# EAGLE design CorruptCore (EAGLE 8.3.1)
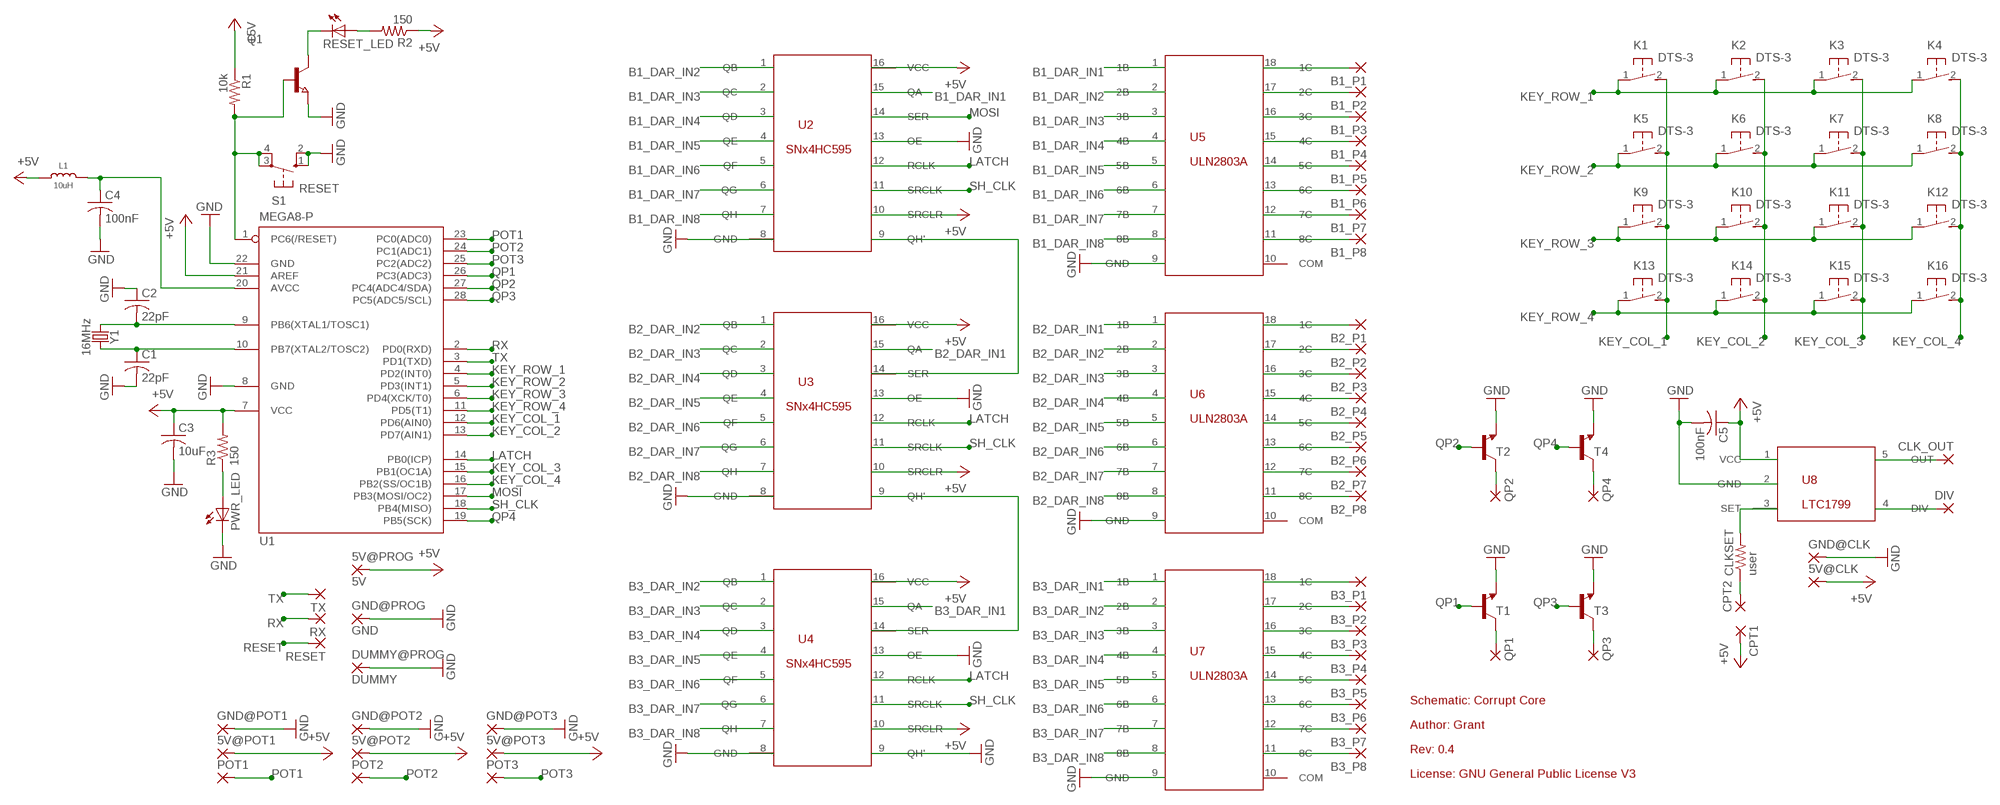
[diagram p0: schematic, sheet 1]

## Parts
5V@CLK  1,6/0,8  [1,6/0,8]
5V@POT1  1,6/0,8  [1,6/0,8]
5V@POT2  1,6/0,8  [1,6/0,8]
5V@POT3  1,6/0,8  [1,6/0,8]
5V@PROG  5V  1,6/0,8  [1,6/0,8]
B1_P1  1,6/0,8  [1,6/0,8]
B1_P2  1,6/0,8  [1,6/0,8]
B1_P3  1,6/0,8  [1,6/0,8]
B1_P4  1,6/0,8  [1,6/0,8]
B1_P5  1,6/0,8  [1,6/0,8]
B1_P6  1,6/0,8  [1,6/0,8]
B1_P7  1,6/0,8  [1,6/0,8]
B1_P8  1,6/0,8  [1,6/0,8]
B2_P1  1,6/0,8  [1,6/0,8]
B2_P2  1,6/0,8  [1,6/0,8]
B2_P3  1,6/0,8  [1,6/0,8]
B2_P4  1,6/0,8  [1,6/0,8]
B2_P5  1,6/0,8  [1,6/0,8]
B2_P6  1,6/0,8  [1,6/0,8]
B2_P7  1,6/0,8  [1,6/0,8]
B2_P8  1,6/0,8  [1,6/0,8]
B3_P1  1,6/0,8  [1,6/0,8]
B3_P2  1,6/0,8  [1,6/0,8]
B3_P3  1,6/0,8  [1,6/0,8]
B3_P4  1,6/0,8  [1,6/0,8]
B3_P5  1,6/0,8  [1,6/0,8]
B3_P6  1,6/0,8  [1,6/0,8]
B3_P7  1,6/0,8  [1,6/0,8]
B3_P8  1,6/0,8  [1,6/0,8]
C1  22pF  C-USC0805  [C0805]
C2  22pF  C-USC0805  [C0805]
C3  10uF  C-USC0805  [C0805]
C4  100nF  C-USC0805  [C0805]
C5  100nF  C-USC0805  [C0805]
CLK_OUT  1,6/0,8  [1,6/0,8]
CLKSET  user  R-US_0207/7  [0207/7]
CPT1  1,6/0,8  [1,6/0,8]
CPT2  1,6/0,8  [1,6/0,8]
DIV  1,6/0,8  [1,6/0,8]
DUMMY@PROG  DUMMY  1,6/0,8  [1,6/0,8]
GND@CLK  1,6/0,8  [1,6/0,8]
GND@POT1  1,6/0,8  [1,6/0,8]
GND@POT2  1,6/0,8  [1,6/0,8]
GND@POT3  1,6/0,8  [1,6/0,8]
GND@PROG  GND  1,6/0,8  [1,6/0,8]
K1  DTS-3  [DTS-3]
K2  DTS-3  [DTS-3]
K3  DTS-3  [DTS-3]
K4  DTS-3  [DTS-3]
K5  DTS-3  [DTS-3]
K6  DTS-3  [DTS-3]
K7  DTS-3  [DTS-3]
K8  DTS-3  [DTS-3]
K9  DTS-3  [DTS-3]
K10  DTS-3  [DTS-3]
K11  DTS-3  [DTS-3]
K12  DTS-3  [DTS-3]
K13  DTS-3  [DTS-3]
K14  DTS-3  [DTS-3]
K15  DTS-3  [DTS-3]
K16  DTS-3  [DTS-3]
L1  10uH  MICROBUILDER_INDUCTOR_0805  [MICROBUILDER__0805]
POT1  1,6/0,8  [1,6/0,8]
POT2  1,6/0,8  [1,6/0,8]
POT3  1,6/0,8  [1,6/0,8]
PWR_LED  LEDCHIPLED_0603  [CHIPLED_0603]
Q1  NPN-TRANSISTOR_SOT23  [SOT23]
QP1  1,6/0,8  [1,6/0,8]
QP2  1,6/0,8  [1,6/0,8]
QP3  1,6/0,8  [1,6/0,8]
QP4  1,6/0,8  [1,6/0,8]
R1  10k  R-US_R0805  [R0805]
R2  150  R-US_R0805  [R0805]
R3  150  R-US_R0805  [R0805]
RESET  1,6/0,8  [1,6/0,8]
RESET_LED  LEDCHIPLED_0603  [CHIPLED_0603]
RX  1,6/0,8  [1,6/0,8]
S1  RESET  10-XX  [B3F-10XX]
T1  TRANS_NPN-MMBTA42  [SOT23-3]
T2  TRANS_NPN-MMBTA42  [SOT23-3]
T3  TRANS_NPN-MMBTA42  [SOT23-3]
T4  TRANS_NPN-MMBTA42  [SOT23-3]
TX  1,6/0,8  [1,6/0,8]
U1  MEGA8-P  [DIL28-3]
U2  SNX4HC595SOIC16  [SOIC16N]
U3  SNX4HC595SOIC16  [SOIC16N]
U4  SNX4HC595SOIC16  [SOIC16N]
U5  ULN2803ASOIC18  [SO18L]
U6  ULN2803ASOIC18  [SO18L]
U7  ULN2803ASOIC18  [SO18L]
U8  LTC1799  [SOT23-5L]
Y1  16MHz  CRYSTAL-16MHZPTH-HC49US  [HC49US]

## Nets
+5V: 5V@CLK.1(P) 5V@POT1.1(P) 5V@POT2.1(P) 5V@POT3.1(P) 5V@PROG.1(P) C3.1 C5.1 CPT1.1(P) L1.1 R1.1 R2.1 R3.2 U1.7(VCC) U1.21(AREF) U2.10(SRCLR) U2.16(VCC) U3.10(SRCLR) U3.16(VCC) U4.10(SRCLR) U4.16(VCC) U8.1(VCC)
B1_DAR_IN1: U2.15(QA) U5.1(1B)
B1_DAR_IN2: U2.1(QB) U5.2(2B)
B1_DAR_IN3: U2.2(QC) U5.3(3B)
B1_DAR_IN4: U2.3(QD) U5.4(4B)
B1_DAR_IN5: U2.4(QE) U5.5(5B)
B1_DAR_IN6: U2.5(QF) U5.6(6B)
B1_DAR_IN7: U2.6(QG) U5.7(7B)
B1_DAR_IN8: U2.7(QH) U5.8(8B)
B1_P1: B1_P1.1(P) U5.18(1C)
B1_P2: B1_P2.1(P) U5.17(2C)
B1_P3: B1_P3.1(P) U5.16(3C)
B1_P4: B1_P4.1(P) U5.15(4C)
B1_P5: B1_P5.1(P) U5.14(5C)
B1_P6: B1_P6.1(P) U5.13(6C)
B1_P7: B1_P7.1(P) U5.12(7C)
B1_P8: B1_P8.1(P) U5.11(8C)
B2_DAR_IN1: U3.15(QA) U6.1(1B)
B2_DAR_IN2: U3.1(QB) U6.2(2B)
B2_DAR_IN3: U3.2(QC) U6.3(3B)
B2_DAR_IN4: U3.3(QD) U6.4(4B)
B2_DAR_IN5: U3.4(QE) U6.5(5B)
B2_DAR_IN6: U3.5(QF) U6.6(6B)
B2_DAR_IN7: U3.6(QG) U6.7(7B)
B2_DAR_IN8: U3.7(QH) U6.8(8B)
B2_P1: B2_P1.1(P) U6.18(1C)
B2_P2: B2_P2.1(P) U6.17(2C)
B2_P3: B2_P3.1(P) U6.16(3C)
B2_P4: B2_P4.1(P) U6.15(4C)
B2_P5: B2_P5.1(P) U6.14(5C)
B2_P6: B2_P6.1(P) U6.13(6C)
B2_P7: B2_P7.1(P) U6.12(7C)
B2_P8: B2_P8.1(P) U6.11(8C)
B3_DAR_IN1: U4.15(QA) U7.1(1B)
B3_DAR_IN2: U4.1(QB) U7.2(2B)
B3_DAR_IN3: U4.2(QC) U7.3(3B)
B3_DAR_IN4: U4.3(QD) U7.4(4B)
B3_DAR_IN5: U4.4(QE) U7.5(5B)
B3_DAR_IN6: U4.5(QF) U7.6(6B)
B3_DAR_IN7: U4.6(QG) U7.7(7B)
B3_DAR_IN8: U4.7(QH) U7.8(8B)
B3_P1: B3_P1.1(P) U7.18(1C)
B3_P2: B3_P2.1(P) U7.17(2C)
B3_P3: B3_P3.1(P) U7.16(3C)
B3_P4: B3_P4.1(P) U7.15(4C)
B3_P5: B3_P5.1(P) U7.14(5C)
B3_P6: B3_P6.1(P) U7.13(6C)
B3_P7: B3_P7.1(P) U7.12(7C)
B3_P8: B3_P8.1(P) U7.11(8C)
GND: C1.2 C2.1 C3.2 C4.2 C5.2 DUMMY@PROG.1(P) GND@CLK.1(P) GND@POT1.1(P) GND@POT2.1(P) GND@POT3.1(P) GND@PROG.1(P) PWR_LED.C Q1.2(E) S1.1(S) S1.2(S1) T1.2(E) T2.2(E) T3.2(E) T4.2(E) U1.8(GND) U1.22(GND) U2.8(GND) U2.13(OE) U3.8(GND) U3.13(OE) U4.8(GND) U4.9(QH') U4.13(OE) U5.9(GND) U6.9(GND) U7.9(GND) U8.2(GND)
KEY_COL_1: K1.2 K5.2 K9.2 K13.2 U1.12(PD6(AIN0))
KEY_COL_2: K2.2 K6.2 K10.2 K14.2 U1.13(PD7(AIN1))
KEY_COL_3: K3.2 K7.2 K11.2 K15.2 U1.15(PB1(OC1A))
KEY_COL_4: K4.2 K8.2 K12.2 K16.2 U1.16(PB2(SS/OC1B))
KEY_ROW_1: K1.1 K2.1 K3.1 K4.1 U1.4(PD2(INT0))
KEY_ROW_2: K5.1 K6.1 K7.1 K8.1 U1.5(PD3(INT1))
KEY_ROW_3: K9.1 K10.1 K11.1 K12.1 U1.6(PD4(XCK/T0))
KEY_ROW_4: K13.1 K14.1 K15.1 K16.1 U1.11(PD5(T1))
LATCH: U1.14(PB0(ICP)) U2.12(RCLK) U3.12(RCLK) U4.12(RCLK)
MOSI: U1.17(PB3(MOSI/OC2)) U2.14(SER)
N$1: U2.9(QH') U3.14(SER)
N$2: U3.9(QH') U4.14(SER)
N$3: C2.2 U1.9(PB6(XTAL1/TOSC1)) Y1.1
N$4: C1.1 U1.10(PB7(XTAL2/TOSC2)) Y1.2
N$5: CLK_OUT.1(P) U8.5(OUT)
N$6: R2.2 RESET_LED.A
N$7: PWR_LED.A R3.1
N$8: QP1.1(P) T1.3(C)
N$9: C4.1 L1.2 U1.20(AVCC)
N$10: QP2.1(P) T2.3(C)
N$11: QP3.1(P) T3.3(C)
N$12: QP4.1(P) T4.3(C)
N$13: DIV.1(P) U8.4(DIV)
N$14: CLKSET.1 CPT2.1(P)
N$16: CLKSET.2 U8.3(SET)
N$17: Q1.3(C) RESET_LED.C
POT1: POT1.1(P) U1.23(PC0(ADC0))
POT2: POT2.1(P) U1.24(PC1(ADC1))
POT3: POT3.1(P) U1.25(PC2(ADC2))
QP1: T1.1(B) U1.26(PC3(ADC3))
QP2: T2.1(B) U1.27(PC4(ADC4/SDA))
QP3: T3.1(B) U1.28(PC5(ADC5/SCL))
QP4: T4.1(B) U1.19(PB5(SCK))
RESET: Q1.1(B) R1.2 RESET.1(P) S1.3(P) S1.4(P1) U1.1(PC6(/RESET))
RX: RX.1(P) U1.2(PD0(RXD))
SH_CLK: U1.18(PB4(MISO)) U2.11(SRCLK) U3.11(SRCLK) U4.11(SRCLK)
TX: TX.1(P) U1.3(PD1(TXD))
Unconnected: U5.10(COM) U6.10(COM) U7.10(COM)

## Notes on the sheet
- Schematic: Corrupt Core
- Author: Grant
- Rev: 0.4
- License: GNU General Public License V3

## Library data of the parts
5V@CLK 5V@POT1-5V@POT3 5V@PROG B1_P1-B1_P8 B2_P1-B2_P8 B3_P1-B3_P8 CLK_OUT CPT1 CPT2 DIV DUMMY@PROG GND@CLK GND@POT1-GND@POT3 GND@PROG POT1-POT3 QP1-QP4 RESET RX TX = wirepad:1,6/0,8: THROUGH-HOLE PAD
C1-C5 = resistor:C-US: CAPACITOR, American symbol
CLKSET R1-R3 = resistor:R-US_: RESISTOR, American symbol
K1-K16 = switch-tact:DTS-3
L1 = piboy_new:MICROBUILDER_INDUCTOR: Inductors 0603: 10nH Ceramic Inductor - microwire antenna/RF (Digikey: 712-1434-2-ND) 0805: 560nH Ceramic Inductor - RF (Digikey: 553-1047-1-ND) 270nH Ceramic Inductor - Q = 40@250MHz, +-5%, 1 Ohm DC Resistance (Digikey: 535-10506-2-ND) 1007 (2518 Metric) SMT: 10µH 10% 250mOhm 820mA 1007 Inductor (Digikey: 587-2189-1-ND) 22µH 10% 500mOhm 580mA 1007 Inductor (Digikey: 587-2190-1-ND) 47µH 10% 950mOhm 420mA 1007 Inductor (Digikey: 587-2191-1-ND) 47µH 5% 100mOhm 1A 1008 Inductor (Digikey: 732-1816-1-ND) 5.0x5.0mm (Taiyo Yuden NR5040 Series) 6.8µH 20% 2.3A 64mOhm Inductor (Digikey: 587-2374-2-ND) 5.0x5.0mm (TDK VLC5045 Series) 4.7µH 20% 3.3A 34mOhm Inductor (Digikey: 445-6526-1-ND) 6.8µH 20% 2.7A 46mOhm Inductor (Digikey: 445-6527-1-ND) 6.0x6.0mm (TDK VLC6045 Series) 4.7µH 20% 3.8A 27mOhm Inductor (Digikey: 445-6538-2-ND) 6.8µH 20% 3A 41mOhm Inductor (Digikey: 445-6540-1-ND) 6.2µH 30% 2.2A 45mOhm Inductor (Digikey: SRR5028-6R2YCT-ND) - Not TDK VLC6045 but footprint should match 6.0x6.0mm (TDK SLF6045 Series) 6.8uH 30% 2A 33mOhm Inductor (Digikey: 445-4572-1-ND, Mouser: 810-SLF645T6R8N2R0PF) 6.0x6.0mm (Sumida CDRH5D28 Series) 6.2uH 30% 1.8A 45mOhm Inductor (Digikey: 308-1542-1-ND) Taiyo Yuden NR3015T2R2M - 2.2uH 20% 1.5A (Digikey: 587-1648-2-ND, Mouser: 963-NR3015T2R2M) - Used with TI TPS62172 CoilCraft RFID Transponder Coil - MA5532-AE (For use with AS3935 Lightning Sensor) Vishay IHLP 1.0uH Molded Inductor - 24mOhm DCR, 5A, +/-20%, -55°C-125°C (Digikey: 541-1319-1-ND)
PWR_LED RESET_LED = led:LED: LED OSRAM: - CHIPLED LG R971, LG N971, LY N971, LG Q971, LY Q971, LO R971, LY R971 LH N974, LH R974 LS Q976, LO Q976, LY Q976 LO Q996 - Hyper CHIPLED LW Q18S LB Q993, LB Q99A, LB R99A - SideLED LS A670, LO A670, LY A670, LG A670, LP A670 LB A673, LV A673, LT A673, LW A673 LH A674 LY A675 LS A676, LA A676, LO A676, LY A676, LW A676 LS A679, LY A679, LG A679 - Hyper Micro SIDELED® LS Y876, LA Y876, LO Y876, LY Y876 LT Y87S - SmartLED LW L88C, LW L88S LB L89C, LB L89S, LG L890 LS L89K, LO L89K, LY L89K LS L896, LA L896, LO L896, LY L896 - TOPLED LS T670, LO T670, LY T670, LG T670, LP T670 LSG T670, LSP T670, LSY T670, LOP T670, LYG T670 LG T671, LOG T671, LSG T671 LB T673, LV T673, LT T673, LW T673 LH T674 LS T676, LA T676, LO T676, LY T676, LB T676, LH T676, LSB T676, LW T676 LB T67C, LV T67C, LT T67C, LS T67K, LO T67K, LY T67K, LW E67C LS E67B, LA E67B, LO E67B, LY E67B, LB E67C, LV E67C, LT E67C LW T67C LS T679, LY T679, LG T679 LS T770, LO T770, LY T770, LG T770, LP T770 LB T773, LV T773, LT T773, LW T773 LH T774 LS E675, LA E675, LY E675, LS T675 LS T776, LA T776, LO T776, LY T776, LB T776 LHGB T686 LT T68C, LB T68C - Hyper Mini TOPLED® LB M676 - Mini TOPLED Santana® LG M470 LS M47K, LO M47K, LY M47K Source: http://www.osram.convergy.de LUXEON: - LUMILED® LXK2-PW12-R00, LXK2-PW12-S00, LXK2-PW14-U00, LXK2-PW14-V00 LXK2-PM12-R00, LXK2-PM12-S00, LXK2-PM14-U00 LXK2-PE12-Q00, LXK2-PE12-R00, LXK2-PE12-S00, LXK2-PE14-T00, LXK2-PE14-U00 LXK2-PB12-K00, LXK2-PB12-L00, LXK2-PB12-M00, LXK2-PB14-N00, LXK2-PB14-P00, LXK2-PB14-Q00 LXK2-PR12-L00, LXK2-PR12-M00, LXK2-PR14-Q00, LXK2-PR14-R00 LXK2-PD12-Q00, LXK2-PD12-R00, LXK2-PD12-S00 LXK2-PH12-R00, LXK2-PH12-S00 LXK2-PL12-P00, LXK2-PL12-Q00, LXK2-PL12-R00 Source: www.luxeon.com KINGBRIGHT: KA-3528ASYC Source: www.kingbright.com
Q1 = semicon-smd-ipc:NPN-TRANSISTOR_: NPN TRANSISTOR
S1 = switch-omron:10-XX: OMRON SWITCH; MPN: B3F-1000; OC_FARNELL: 176432; OC_NEWARK: 36M3542
T1-T4 = SparkFun-DiscreteSemi:TRANS_NPN: NPN transistor Current controlled devices typically used to amplify current or used as a switch. BC547 - COM-08928 <http://www.sparkfun.com/products/8928> (TO-92 45V 100mA) (1.Collector 2.Base 3.Emitter) 2N3904 - COM-00521 <http://www.sparkfun.com/products/521> (TO-92 40V 200mA) (1.Emitter 2.Base 3.Collector) P2N2222A - COM-12852 <http://www.sparkfun.com/products/12852> (TO-92 40V 600mA) (1.Collector 2.Base 3.Emitter); PROD_ID: TRANS-09116; VALUE: 500mA/300V
U1 = atmel:MEGA8-P: MICROCONTROLLER 8 Kbytes FLASH, 1 kbytes SRAM, 512 bytes EEPROM, USART, 4-channel 10 bit ADC, 2-channel 8 bit ADC Pin compatible with Atmega48, ATMega88, ATMega168 Source: avr.lbr; OC_FARNELL: unknown; OC_NEWARK: unknown
U2-U4 = CorruptCore:SNX4HC595
U5-U7 = CorruptCore:ULN2803A
U8 = CorruptCore:LTC1799
Y1 = SparkFun-Clocks:CRYSTAL-16MHZ: 16MHz Crystal Digikey Example <http://www.digikey.com/product-search/en?keywords=535-9122-1-ND> Frequency: 16MHz Frequency Stability: ±50ppm Frequency Tolerance: ±20ppm Load Capacitance: 18pF SparkFun Products: Pro Micro -5V/16MHz <https://www.sparkfun.com/products/12640> SparkFun Serial Enabled LCD Kit <https://www.sparkfun.com/products/10097>; PROD_ID: XTAL-08181; SF_ID: COM-00536

## Board
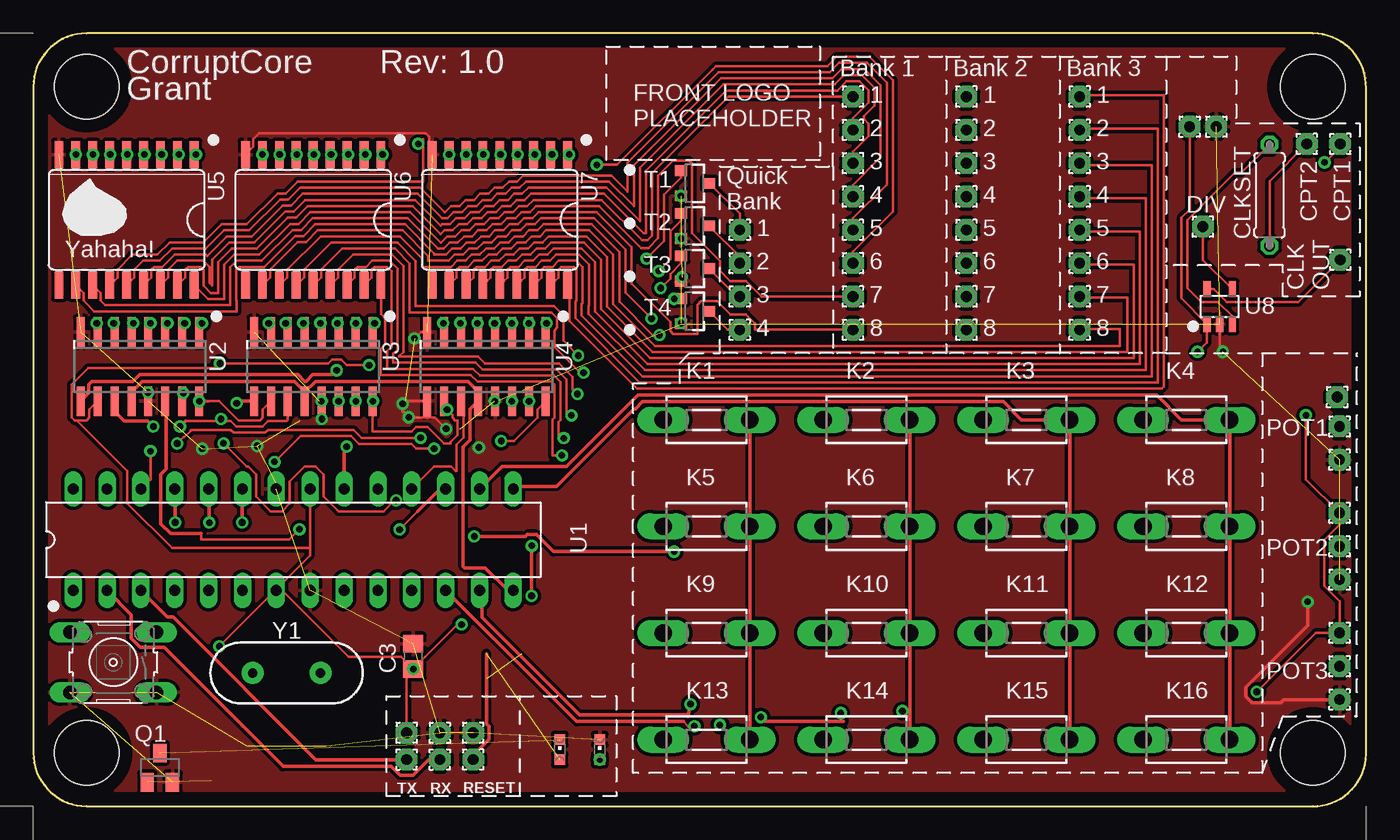
[diagram p1: board, top side]
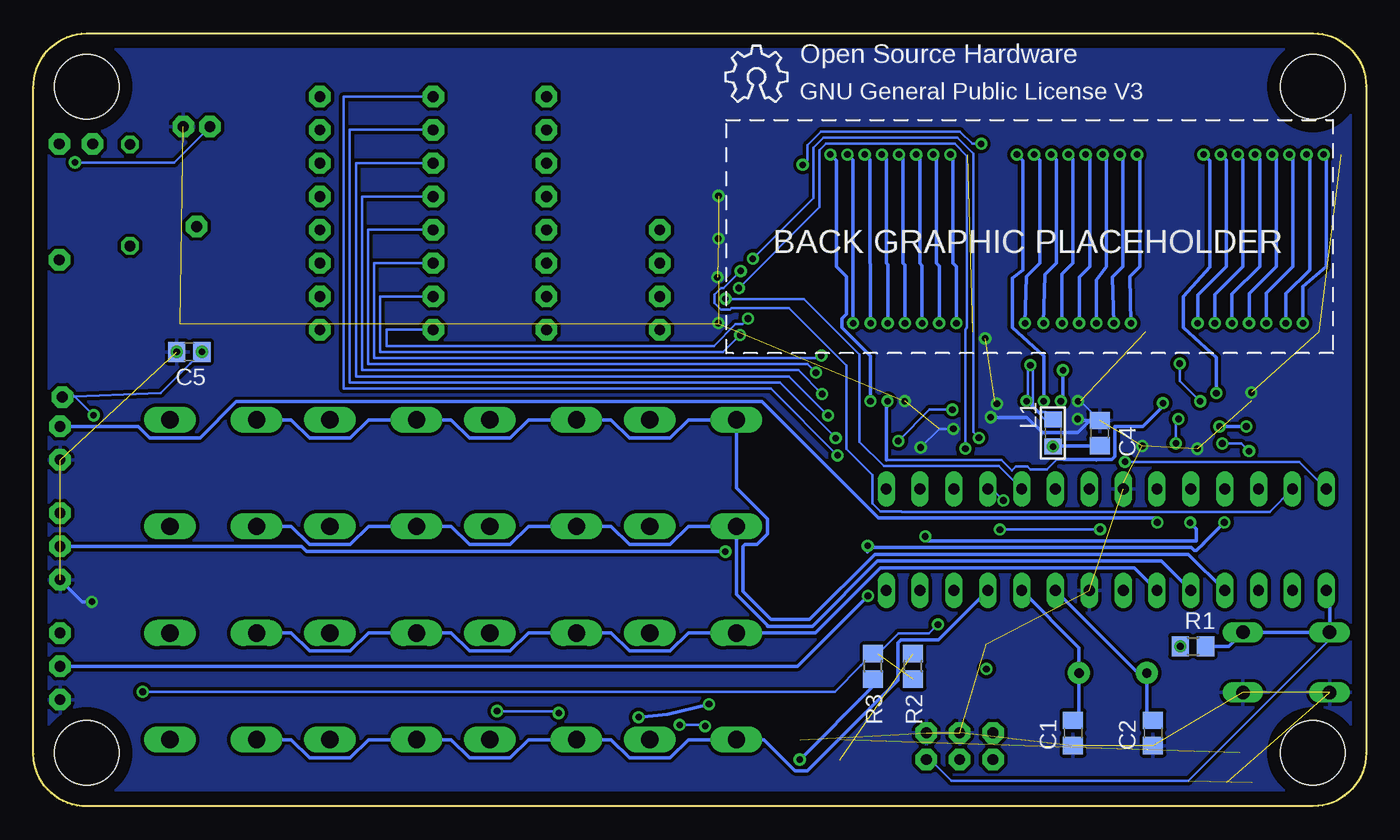
[diagram p2: board, bottom side, seen from below]

Size 100 x 58 mm. Coordinates in mm from the lower left corner, seen from the top.
Outline: 4,0 96,0 arc90 100,3.9 100,53.9 arc90 96,58 4,58 arc90 0,54 0,4 arc90 4,0
Copper layers (1*16): Top 0.035mm / dielectric 1.5mm / Bottom 0.035mm
Design rules "default *": minimum track width 8mil, minimum drill 0.45mm, track to track 10mil, track to pad 10mil, pad to pad 10mil, via to via 15mil, smd to smd 0mil, copper to edge 40mil, drill to drill 15mil, minimum pad ring 10mil, minimum via ring 8mil, stop-mask expansion 4mil, vias tented up to drill 0mil, thermal gap 10mil
Holes 4.83 mm at 4,4 96,4 96,54 4,54

### Footprints (pad centres in the part's own frame; a part is rotated, then mirrored left to right if it is on the bottom)
1,6/0,8 = drill 0.813 pad 1.6 octagon: 1 0,0
C0805 = smd 1.3 x 1.5: 1 -0.95,0; 2 0.95,0
0207/7 = drill 0.813 octagon: 1 -3.81,0; 2 3.81,0
DTS-3 = drill 1.3 long: 1 -3.25,0; 2 3.25,0
MICROBUILDER__0805 = smd 1.2 x 1.3: 1 -1.016,0; 2 1.016,0
CHIPLED_0603 = smd 0.8 x 0.8: A 0,-0.75; C 0,0.75
SOT23 = smd 1 x 1.4: 1 -0.95,-1.1; 2 0.95,-1.1; 3 0,1.1
R0805 = smd 1.3 x 1.5: 1 -0.95,0; 2 0.95,0
B3F-10XX = drill 1.016 long: 1 -3.251,2.261; 2 3.251,2.261; 3 -3.251,-2.261; 4 3.251,-2.261
SOT23-3 = smd 0.8 x 0.9: 1 -0.95,-1; 2 0.95,-1; 3 0,1.1
DIL28-3 = drill 0.813 long: 1 -16.51,-3.81; 2 -13.97,-3.81; 3 -11.43,-3.81; 4 -8.89,-3.81; 5 -6.35,-3.81; 6 -3.81,-3.81; 7 -1.27,-3.81; 8 1.27,-3.81; 9 3.81,-3.81; 10 6.35,-3.81; 11 8.89,-3.81; 12 11.43,-3.81; 13 13.97,-3.81; 14 16.51,-3.81; 15 16.51,3.81; 16 13.97,3.81; 17 11.43,3.81; 18 8.89,3.81; 19 6.35,3.81; 20 3.81,3.81; 21 1.27,3.81; 22 -1.27,3.81; 23 -3.81,3.81; 24 -6.35,3.81; 25 -8.89,3.81; 26 -11.43,3.81; 27 -13.97,3.81; 28 -16.51,3.81
SOIC16N = smd 0.6 x 2.2: 1 -4.445,-2.6; 2 -3.175,-2.6; 3 -1.905,-2.6; 4 -0.635,-2.6; 5 0.635,-2.6; 6 1.905,-2.6; 7 3.175,-2.6; 8 4.445,-2.6; 9 4.445,2.6; 10 3.175,2.6; 11 1.905,2.6; 12 0.635,2.6; 13 -0.635,2.6; 14 -1.905,2.6; 15 -3.175,2.6; 16 -4.445,2.6
SO18L = smd 0.66 x 2.032: 1 -5.08,-4.902; 2 -3.81,-4.902; 3 -2.54,-4.902; 4 -1.27,-4.902; 5 0,-4.902; 6 1.27,-4.902; 7 2.54,-4.902; 8 3.81,-4.902; 9 5.08,-4.902; 10 5.08,4.902; 11 3.81,4.902; 12 2.54,4.902; 13 1.27,4.902; 14 0,4.902; 15 -1.27,4.902; 16 -2.54,4.902; 17 -3.81,4.902; 18 -5.08,4.902
SOT23-5L = smd 0.55 x 1.2: 1 -0.95,-1.3; 2 0,-1.3; 3 0.95,-1.3; 4 0.95,1.3; 5 -0.95,1.3
HC49US = drill 0.7 pad 1.651: 1 -2.54,0; 2 2.54,0

### Placement (x,y rotation side)
5V@CLK  86.75,51 90 top
5V@POT1  97.82,30.7 0 top
5V@POT2  98,22 0 top
5V@POT3  98,13 0 top
5V@PROG  28,5.5 0 top
B1_P1  61.5,53.25 0 top
B1_P2  61.5,50.75 0 top
B1_P3  61.5,48.25 0 top
B1_P4  61.5,45.75 0 top
B1_P5  61.5,43.25 0 top
B1_P6  61.5,40.75 0 top
B1_P7  61.5,38.25 0 top
B1_P8  61.5,35.75 0 top
B2_P1  70,53.25 0 top
B2_P2  70,50.75 0 top
B2_P3  70,48.25 0 top
B2_P4  70,45.75 0 top
B2_P5  70,43.25 0 top
B2_P6  70,40.75 0 top
B2_P7  70,38.25 0 top
B2_P8  70,35.75 0 top
B3_P1  78.5,53.25 0 top
B3_P2  78.5,50.75 0 top
B3_P3  78.5,48.25 0 top
B3_P4  78.5,45.75 0 top
B3_P5  78.5,43.25 0 top
B3_P6  78.5,40.75 0 top
B3_P7  78.5,38.25 0 top
B3_P8  78.5,35.75 0 top
C1  22,5.5 270 bottom
C2  16,5.5 90 bottom
C3  28.5,11.25 90 top
C4  20,28 90 bottom
C5  88.3,34.1 180 bottom
CLK_OUT  98.05,41 0 top
CLKSET  92.75,45.85 90 top
CPT1  98.05,49.7 270 top
CPT2  95.55,49.7 270 top
DIV  87.75,43.5 0 top
DUMMY@PROG  33,5.5 0 top
GND@CLK  88.75,51 90 top
GND@POT1  98,26 0 top
GND@POT2  98,17 0 top
GND@POT3  98,8 0 top
GND@PROG  30.5,5.5 0 top
K1  50.5,29 0 top
K2  62.5,29 0 top
K3  74.5,29 0 top
K4  86.5,29 0 top
K5  50.5,21 0 top
K6  62.5,21 0 top
K7  74.5,21 0 top
K8  86.5,21 0 top
K9  50.5,13 0 top
K10  62.5,13 0 top
K11  74.5,13 0 top
K12  86.5,13 0 top
K13  50.5,5 0 top
K14  62.5,5 0 top
K15  74.5,5 0 top
K16  86.5,5 0 top
L1  23.5,28 270 bottom
POT1  98,28.5 0 top
POT2  98,19.5 0 top
POT3  98,10.5 0 top
PWR_LED  42.5,4.25 0 top
Q1  9.5,2.9 0 top
QP1  53,43.25 0 top
QP2  53,40.75 0 top
QP3  53,38.25 0 top
QP4  53,35.75 0 top
R1  13,12 0 bottom
R2  34,10.5 90 bottom
R3  37,10.5 90 bottom
RESET  33,3.5 0 top
RESET_LED  39.5,4.25 0 top
RX  30.5,3.5 180 top
S1  6,10.8 180 top
T1  49.6,46.75 270 top
T2  49.6,43.55 270 top
T3  49.6,40.35 270 top
T4  49.6,37.15 270 top
TX  28,3.5 180 top
U1  19.5,20 0 top
U2  8,33 180 top
U3  21,33 180 top
U4  34,33 180 top
U5  7,44 180 top
U6  21,44 180 top
U7  35,44 180 top
U8  89,37.5 0 top
Y1  19,10 0 top

### Tracks (layer width: path | path; a pad name or v marks a point on that pad's centre or on a via)
+5V  (via drill 0.5)  (1 unrouted)
  Top 0.203: U3.10 17.21,29.79 17.21,29.15 17,28.94 15.41,28.94 13.96,30.4 13.17,30.4 | 13.17,30.4 U2.16 | 3.25,28.94 4,28.94 4.21,29.15 4.21,29.79 U2.10 | 3.25,28.94 3.11,28.94 2.9,29.15 2.9,31.65 4.12,32.87 13.64,32.87 v13.99,33.22 22.11,33.22 22.41,33.52 23.09,33.52 23.51,33.1 v25.2,33.1 | v12.46,30.39 13.16,30.39 13.17,30.4 | U4.10 30.82,29.97 30.94,29.85 v31.04,29.75 31.44,29.35 31.44,29.15 31.65,28.94 31.84,28.94 31.84,27.87 31.31,27.34 31.31,27.23 30.82,27.23 29.6,28.45 28.73,28.45 28.38,28.1 25.46,28.1 25.46,30.38 v25.48,30.4 25.4,30.48 U3.16 | U4.16 37.83,29.79 37.83,29.15 36.08,27.41 v35.1,27.41 | C5.1 88.05,34.8 U8.1 86.14,38.11 86.14,44.17 86.75,44.78 5V@CLK.1 | CPT1.1 98.05,49.48 v96.88,48.31 | v95.48,29.34 95.48,24.52 5V@POT2.1 98,21.13 96.84,19.98 96.84,16.52 98,15.37 5V@POT3.1 96.21,13 v91.8,8.59 | 18.14,16.19 U1.7 18.67,16.19 23.67,11.19 27.61,11.19 C3.1 | 18.14,16.19 R1.1 | 5V@PROG.1 28,9.8 C3.1 | C3.1 29.39,11.19 29.4,11.19 31.84,13.63 v32.12,13.63 | 20.77,19.31 U1.21 | 20.77,19.31 20.77,18.82 18.14,16.19 | 3.25,28.94 7.05,25.14 7.05,22.73 10.4,19.38 20.7,19.38 20.77,19.31
  Bottom 0.203: 24.1,29.02 v25.48,30.4 25.4,30.48 25.4,33.02 v25.2,33.1 25,32.92 25,30.07 24.53,29.59 24.07,29.59 L1.1 | v13.99,33.22 13.99,31.93 v12.46,30.39 | v31.04,29.75 32.76,29.75 v35.1,27.41 | v96.88,48.31 89.44,48.31 5V@CLK.1 | C5.1 88.24,33.21 88.24,33.2 90.45,31 5V@POT1.1 97.14,31 v95.48,29.34 | v32.12,13.63 32.8,12.96 35.11,12.96 36.62,11.45 R3.2 37.89,10.56 37.9,10.56 39.87,8.59 v91.8,8.59
  other vias: 87.35,34.1 13.95,12 28.5,10.3
B1_DAR_IN1  (via drill 0.5)
  Top 0.254: U2.15 11.18,30.93 v11.25,31 | v12.2,48.9 U5.1
  Bottom 0.254: v11.25,31 11.25,33.67 13.73,35.9 13.73,38.23 11.75,40.47 11.75,48.45 v12.2,48.9
B1_DAR_IN2  (via drill 0.5)
  Top 0.254: U2.1 12.45,36.05 v12.65,36.25 | v10.91,48.9 10.91,48.41 10.75,48.25 10.75,48.84 U5.2
  Bottom 0.254: v12.65,36.25 12.65,38.35 10.5,40.5 10.5,48.49 v10.91,48.9
B1_DAR_IN3  (via drill 0.5)
  Top 0.254: U2.2 11.18,36.06 v11.36,36.25 | v9.63,48.9 9.63,48.38 9.5,48.25 9.5,48.86 U5.3
  Bottom 0.254: v11.36,36.25 11.36,38.39 9.25,40.5 9.25,48.52 v9.63,48.9
B1_DAR_IN4  (via drill 0.5)
  Top 0.254: U2.3 9.9,36.08 v10.07,36.25 | v8.34,48.9 U5.4
  Bottom 0.254: v10.07,36.25 10.07,38.42 8,40.5 8,48.56 v8.34,48.9
B1_DAR_IN5  (via drill 0.5)
  Top 0.254: U2.4 8.63,36.1 v8.79,36.25 | v7.05,48.9 U5.5
  Bottom 0.254: v8.79,36.25 8.79,38.46 6.75,40.5 6.75,48.6 v7.05,48.9
B1_DAR_IN6  (via drill 0.5)
  Top 0.254: U2.5 7.37,36.12 v7.5,36.25 | v5.76,48.9 U5.6
  Bottom 0.254: v7.5,36.25 7.5,38.5 5.5,40.5 5.5,48.64 v5.76,48.9
B1_DAR_IN7  (via drill 0.5)
  Top 0.254: U2.6 6.09,36.19 v6.04,36.25 | v4.48,48.9 U5.7
  Bottom 0.254: v6.04,36.25 6.04,38.46 4.25,40.25 4.25,48.67 v4.48,48.9
B1_DAR_IN8  (via drill 0.5)
  Top 0.254: U2.7 4.83,36.17 v4.75,36.25
  Bottom 0.254: v4.75,36.25 4.75,39 3,40.5 3,48.84 U5.8
  other vias: 3.19,48.9
B1_P1
  Top 0.203: U5.18 13.13,38.05 14.32,38.05 14.32,40.64 15.06,41.38 16.96,41.38 19.27,43.7 19.89,43.7 20.78,44.58 28.26,44.58 30.55,42.3 30.58,42.3 31.04,42.76 31.66,42.76 32.12,43.21 32.74,43.21 33.2,43.67 33.82,43.67 34.28,44.13 34.9,44.13 35.36,44.58 35.98,44.58 36.44,45.04 37.06,45.04 37.52,45.5 42.64,45.5 45.67,42.47 46.08,42.47 46.42,42.81 46.42,47.52 52.16,53.25 B1_P1.1
B1_P2
  Top 0.203: U5.17 11.39,39.68 11.39,40.26 11.6,40.47 12.56,40.47 12.77,40.26 12.77,39.06 13.32,38.51 13.86,38.51 13.86,40.83 14.87,41.84 16.77,41.84 19.08,44.16 19.7,44.16 20.59,45.04 28.45,45.04 30.56,42.93 30.85,43.21 31.47,43.21 31.93,43.67 32.55,43.67 33.01,44.13 33.63,44.13 34.09,44.58 34.71,44.58 35.17,45.04 35.79,45.04 36.25,45.5 36.87,45.5 37.33,45.96 42.83,45.96 45.79,43 45.97,43 45.97,47.71 51.97,53.71 60.32,53.71 61.02,54.41 61.98,54.41 62.66,53.73 62.66,52.77 61.5,51.62 B1_P2.1
B1_P3
  Top 0.203: U5.16 10.12,39.68 10.12,40.26 10.79,40.93 12.75,40.93 13.22,40.45 13.22,39.25 13.4,39.07 13.4,41.02 14.69,42.3 16.58,42.3 18.89,44.61 19.52,44.61 20.4,45.5 28.64,45.5 30.56,43.58 30.66,43.67 31.28,43.67 31.74,44.13 32.36,44.13 32.82,44.58 33.44,44.58 33.9,45.04 34.52,45.04 34.98,45.5 35.6,45.5 36.06,45.96 36.68,45.96 37.14,46.41 43.02,46.41 45.51,43.92 45.51,47.9 51.78,54.17 60.13,54.17 60.83,54.87 62.17,54.87 63.11,53.92 63.11,52.59 62.31,51.78 62.31,51.58 62.66,51.23 62.66,50.27 61.5,49.12 B1_P3.1
B1_P4
  Top 0.203: B1_P4.1 61.5,46.62 63.57,48.69 63.57,54.11 62.36,55.32 60.64,55.32 59.94,54.63 51.59,54.63 45.05,48.09 45.05,47.49 | 45.05,47.49 | U5.15 8.85,39.68 8.85,40.26 9.06,40.47 9.69,40.47 10.6,41.38 12.94,41.38 13.03,41.29 14.5,42.76 16.39,42.76 18.7,45.07 19.33,45.07 20.21,45.96 28.83,45.96 30.66,44.13 31.09,44.13 31.55,44.58 32.17,44.58 32.63,45.04 33.25,45.04 33.71,45.5 34.33,45.5 34.79,45.96 35.41,45.96 35.87,46.41 36.49,46.41 36.95,46.87 43.21,46.87 45.05,45.03 45.05,47.49
B1_P5
  Top 0.203: B1_P5.1 61.5,44.12 64.03,46.65 64.03,54.3 62.55,55.78 60.45,55.78 59.76,55.08 51.78,55.08 | 51.78,55.08 | 51.78,55.08 51.4,55.08 44.59,48.28 44.59,47.3 | 44.59,47.3 44.59,46.13 43.4,47.33 36.76,47.33 36.3,46.87 35.68,46.87 35.22,46.41 34.6,46.41 34.14,45.96 33.52,45.96 33.06,45.5 32.44,45.5 31.98,45.04 31.36,45.04 30.9,44.58 30.85,44.58 29.02,46.41 20.02,46.41 19.14,45.53 18.51,45.53 16.2,43.21 14.69,43.21 | 44.59,47.3 | 14.69,43.21 | 14.69,43.21 14.31,43.21 12.94,41.84 10.41,41.84 9.5,40.93 8.25,40.93 7.58,40.26 7.58,39.68 U5.14
B1_P6  (via drill 0.5)
  Top 0.203: B1_P6.1 61.5,41.62 64.48,44.6 64.48,54.49 62.74,56.24 60.26,56.24 59.56,55.54 51.97,55.54 | 51.97,55.54 | 50.94,55.27 51.21,55.54 51.97,55.54 | 50.94,55.27 | 29.23,50.06 29.23,46.86 29.23,46.85 29.21,46.87 19.83,46.87 18.95,45.98 18.32,45.98 16.01,43.67 14.87,43.67 | 14.87,43.67 | 14.87,43.67 14.12,43.67 12.74,42.3 10.22,42.3 9.31,41.38 7.44,41.38 6.31,40.26 6.31,39.68 U5.13 | 29.23,50.06 | 29.23,50.06 v28.88,49.7 | v42.28,48.14 43.8,48.14 50.94,55.27
  Bottom 0.203: v28.88,49.7 29.55,49.7 30.48,50.62 40.92,50.62 41.92,49.62 41.92,48.49 v42.28,48.14
B1_P7
  Top 0.203: B1_P7.1 54.63,38.25 53.48,39.41 52.29,39.41 51.51,40.19 51.51,40.9 49.41,43 49.41,48.25 49.2,48.46 48,48.46 46.88,47.33 46.88,42.62 46.15,41.89 45.6,41.89 42.45,45.04 37.71,45.04 37.25,44.58 36.63,44.58 36.17,44.13 35.55,44.13 35.09,43.67 34.47,43.67 34.01,43.21 33.39,43.21 32.93,42.76 32.31,42.76 31.85,42.3 31.23,42.3 30.77,41.84 30.36,41.84 28.07,44.13 20.97,44.13 20.08,43.24 19.46,43.24 17.15,40.93 15.25,40.93 14.78,40.45 14.78,37.74 14.78,37.59 5.39,37.59 5.04,37.94 5.04,38.51 U5.12
B1_P8
  Top 0.203: B1_P8.1 54.16,35.75 54.16,36.23 53.48,36.91 52.29,36.91 51.3,37.91 50.1,37.91 49.81,37.62 49.81,35.44 48,35.44 47.79,35.65 47.79,36.32 44.88,39.24 44.88,41.97 42.26,44.58 37.9,44.58 37.44,44.13 36.82,44.13 36.36,43.67 35.74,43.67 35.28,43.21 34.66,43.21 34.2,42.76 33.58,42.76 33.12,42.3 32.49,42.3 32.04,41.84 31.41,41.84 30.96,41.38 30.07,41.38 30.07,41.49 27.88,43.67 21.16,43.67 20.27,42.78 19.65,42.78 17.34,40.47 15.44,40.47 15.23,40.26 15.23,37.94 15.24,37.93 15.24,37.13 4.57,37.13 3.77,37.94 3.77,38.51 U5.11
B2_DAR_IN1  (via drill 0.5)
  Top 0.254: U3.15 v24.19,30.4 | v26.2,48.9 U6.1
  Bottom 0.254: v24.19,30.4 24.19,33.76 26.53,35.9 26.53,39.63 25.75,40.22 25.75,48.45 v26.2,48.9
B2_DAR_IN2  (via drill 0.5)
  Top 0.254: U3.1 25.45,36.2 v25.6,36.25 | v24.91,48.9 U6.2
  Bottom 0.254: v25.6,36.25 25.5,39.75 24.5,40.75 24.5,48.49 v24.91,48.9
B2_DAR_IN3  (via drill 0.5)
  Top 0.254: U3.2 24.18,36.19 v24.21,36.25 | v23.63,48.9 U6.3
  Bottom 0.254: v24.21,36.25 24.11,39.89 23.25,40.75 23.25,48.52 v23.63,48.9
B2_DAR_IN4  (via drill 0.5)
  Top 0.254: U3.3 22.91,36.17 v22.82,36.25 | v22.34,48.9 U6.4
  Bottom 0.254: v22.82,36.25 22.82,39.92 22,40.75 22,48.56 v22.34,48.9
B2_DAR_IN5  (via drill 0.5)
  Top 0.254: U3.4 21.64,36.15 v21.54,36.25 | v21.05,48.9 U6.5
  Bottom 0.254: v21.54,36.25 21.54,39.71 20.75,40.5 20.75,48.6 v21.05,48.9
B2_DAR_IN6  (via drill 0.5)
  Top 0.254: U3.5 20.36,36.12 v20.25,36.25 | v19.77,48.9 U6.6
  Bottom 0.254: v20.25,36.25 20.25,39.5 19.5,40.5 19.5,48.64 v19.77,48.9
B2_DAR_IN7  (via drill 0.5)
  Top 0.254: U3.6 19.09,36.09 v18.94,36.25 | v18.48,48.9 U6.7
  Bottom 0.254: v18.94,36.25 19.04,39.71 18.25,40.5 18.25,48.67 v18.48,48.9
B2_DAR_IN8  (via drill 0.5)
  Top 0.254: U3.7 17.82,36.17 v17.65,36.25
  Bottom 0.254: U6.8 17,48.71 17,40.5 17.75,39.75 v17.65,36.25
  other vias: 17.19,48.9
B2_P1  (via drill 0.5)
  Top 0.203: v39.65,26.33 38.98,26.33 38.96,26.31 38.96,29.02 39.1,29.15 39.1,31.65 38.89,31.86 33.33,31.86 32.82,32.36 26.06,32.36 26.06,34.31 26.41,34.66 26.41,36.59 26.08,36.91 U6.18
  Bottom 0.203: B2_P1.1 76.69,53.25 76.71,53.24 76.71,31.34 44.66,31.34 v39.65,26.33
B2_P2  (via drill 0.5)
  Top 0.203: v39.8,27.62 39.42,27.62 39.42,28.83 39.56,28.96 39.56,31.84 39.08,32.31 33.52,32.31 33.01,32.82 26.54,32.82 26.54,34.15 26.87,34.47 26.87,40.16 26.56,40.47 25.6,40.47 25.39,40.26 25.39,39.68 U6.17
  Bottom 0.203: B2_P2.1 76.25,50.75 76.25,31.8 43.98,31.8 v39.8,27.62
B2_P3  (via drill 0.5)
  Top 0.203: v40.37,29.33 40.02,29.33 40.02,32.03 39.27,32.77 33.71,32.77 33.2,33.28 27,33.28 27,33.96 27.32,34.28 27.32,40.35 26.75,40.93 25.41,40.93 24.96,40.47 24.33,40.47 24.12,40.26 24.12,39.68 U6.16
  Bottom 0.203: B2_P3.1 75.79,48.25 75.79,32.26 43.29,32.26 v40.37,29.33
B2_P4  (via drill 0.5)
  Top 0.203: v40.82,30.93 40.47,31.29 40.47,32.22 39.46,33.23 33.9,33.23 33.39,33.73 27.46,33.73 27.46,33.77 27.78,34.09 27.78,40.54 26.94,41.38 23.98,41.38 22.85,40.26 22.85,39.68 U6.15
  Bottom 0.203: B2_P4.1 75.34,45.75 75.34,32.72 42.6,32.72 v40.82,30.93
B2_P5  (via drill 0.5)
  Top 0.203: v41.28,32.54 41.02,32.54 39.1,34.46 39.1,35.71 39.31,35.91 39.31,36.64 38.89,37.06 28.25,37.06 28.24,37.07 28.24,40.73 27.13,41.84 23.16,41.84 21.58,40.26 21.58,39.68 U6.14
  Bottom 0.203: B2_P5.1 74.88,43.25 74.88,33.17 41.92,33.17 v41.28,32.54
B2_P6  (via drill 0.5)
  Top 0.203: v40.88,33.82 39.77,34.94 39.77,36.83 39.08,37.52 28.7,37.52 28.7,40.92 27.32,42.3 22.35,42.3 20.31,40.26 20.31,39.68 U6.13
  Bottom 0.203: B2_P6.1 74.42,40.75 74.42,33.63 41.07,33.63 v40.88,33.82
B2_P7  (via drill 0.5)
  Top 0.203: v46.97,35.36 46.47,35.36 43.97,37.86 43.97,41.59 41.88,43.67 38.28,43.67 37.82,43.21 37.2,43.21 36.74,42.76 36.12,42.76 35.66,42.3 35.03,42.3 34.58,41.84 33.95,41.84 33.5,41.38 32.87,41.38 32.42,40.93 31.79,40.93 31.34,40.47 29.15,40.47 29.15,41.11 27.5,42.76 21.54,42.76 19.04,40.26 19.04,39.68 U6.12
  Bottom 0.203: B2_P7.1 73.97,38.25 73.97,34.09 48.24,34.09 v46.97,35.36
B2_P8  (via drill 0.5)
  Top 0.203: v46.38,36.59 44.42,38.55 44.42,41.78 42.07,44.13 38.09,44.13 37.63,43.67 37.01,43.67 36.55,43.21 35.93,43.21 35.47,42.76 34.85,42.76 34.39,42.3 33.77,42.3 33.31,41.84 32.68,41.84 32.23,41.38 31.6,41.38 31.15,40.93 29.61,40.93 29.61,41.3 27.69,43.21 21.35,43.21 20.46,42.33 19.84,42.33 17.77,40.26 17.77,39.68 U6.11
  Bottom 0.203: B2_P8.1 73.51,35.75 73.51,34.54 48.93,34.54 47.31,36.16 46.81,36.16 v46.38,36.59
B3_DAR_IN1  (via drill 0.5)
  Top 0.254: U4.15 v37.19,30.4 | v40.2,48.9 U7.1
  Bottom 0.254: v37.19,30.4 37.19,33.76 39.33,35.9 39.33,36.6 39.01,36.92 39.01,39.76 39.75,40.5 39.75,48.45 v40.2,48.9
B3_DAR_IN2  (via drill 0.5)
  Top 0.254: U4.1 38.45,36.2 v38.5,36.25 | v38.91,48.9 U7.2
  Bottom 0.254: v38.5,36.25 38.5,48.49 v38.91,48.9
B3_DAR_IN3  (via drill 0.5)
  Top 0.254: U4.2 37.17,36.24 v37.19,36.25 | v37.63,48.9 U7.3
  Bottom 0.254: v37.19,36.25 37.19,40.69 37.25,40.75 37.25,48.52 v37.63,48.9
B3_DAR_IN4  (via drill 0.5)
  Top 0.254: U4.3 v35.91,36.24 v35.9,36.25 | v36.34,48.9 U7.4
  Bottom 0.254: v35.9,36.25 35.9,40.65 36,40.75 36,48.56 v36.34,48.9
B3_DAR_IN5  (via drill 0.5)
  Top 0.254: U4.4 34.63,36.23 v34.61,36.25 | v35.05,48.9 U7.5
  Bottom 0.254: v34.61,36.25 34.61,40.61 34.75,40.75 34.75,48.6 v35.05,48.9
B3_DAR_IN6  (via drill 0.5)
  Top 0.254: U4.5 33.37,36.21 v33.33,36.25 | v33.77,48.9 U7.6
  Bottom 0.254: v33.33,36.25 33.33,40.58 33.5,40.75 33.5,48.64 v33.77,48.9
B3_DAR_IN7  (via drill 0.5)
  Top 0.254: U4.6 32.09,36.19 v32.04,36.25 | v32.48,48.9 U7.7
  Bottom 0.254: v32.04,36.25 32.04,40.54 32.25,40.75 32.25,48.67 v32.48,48.9
B3_DAR_IN8  (via drill 0.5)
  Top 0.254: U4.7 30.82,36.17 v30.75,36.25
  Bottom 0.254: v30.75,36.25 30.75,40.5 31,40.75 31,48.71 U7.8
  other vias: 31.19,48.9
B3_P1
  Top 0.203: B3_P1.1 78.59,53.34 84.84,53.34 84.84,31.5 84.69,31.35 45.31,31.35 40.23,36.42 40.23,38.05 40.31,38.12 40.31,38.87 U7.18
B3_P2
  Top 0.203: B3_P2.1 78.6,50.85 84.38,50.85 84.38,31.8 45.5,31.8 40.69,36.61 40.69,37.86 40.77,37.94 40.77,40.26 40.56,40.47 39.6,40.47 39.39,40.26 39.39,39.68 U7.17
B3_P3
  Top 0.203: U7.16 38.12,39.68 38.12,40.26 38.33,40.47 38.96,40.47 39.41,40.93 40.75,40.93 41.22,40.45 41.22,37.74 41.15,37.67 41.15,36.8 45.69,32.26 83.92,32.26 83.92,48.11 78.65,48.11 B3_P3.1
B3_P4
  Top 0.203: U7.15 36.85,39.68 36.85,40.26 37.06,40.47 37.69,40.47 38.14,40.93 38.77,40.93 39.22,41.38 40.94,41.38 41.68,40.64 41.68,37.56 41.66,37.54 41.66,36.94 45.88,32.72 83.46,32.72 83.46,45.62 78.64,45.62 B3_P4.1
B3_P5
  Top 0.203: U7.14 35.58,39.68 35.58,40.26 35.79,40.47 36.42,40.47 36.87,40.93 37.5,40.93 37.95,41.38 38.58,41.38 39.03,41.84 41.13,41.84 42.14,40.83 42.14,37.37 42.14,37.11 46.07,33.17 83.01,33.17 83.01,43.13 78.62,43.13 B3_P5.1
B3_P6
  Top 0.203: U7.13 34.31,39.68 34.31,40.26 34.52,40.47 35.15,40.47 35.6,40.93 36.23,40.93 36.68,41.38 37.31,41.38 37.76,41.84 38.39,41.84 38.84,42.3 41.31,42.3 42.59,41.02 42.59,37.3 46.26,33.63 82.55,33.63 82.55,40.64 78.61,40.64 B3_P6.1
B3_P7
  Top 0.203: U7.12 33.04,39.68 33.04,40.26 33.25,40.47 33.88,40.47 34.33,40.93 34.96,40.93 35.41,41.38 36.04,41.38 36.49,41.84 37.12,41.84 37.58,42.3 38.2,42.3 38.66,42.76 41.5,42.76 43.05,41.21 43.05,37.48 46.45,34.09 82.09,34.09 82.09,38.15 78.6,38.15 B3_P7.1
B3_P8
  Top 0.203: U7.11 31.77,39.68 31.77,40.26 31.98,40.47 32.61,40.47 33.06,40.93 33.69,40.93 34.14,41.38 34.77,41.38 35.22,41.84 35.85,41.84 36.3,42.3 36.93,42.3 37.39,42.76 38.01,42.76 38.47,43.21 41.69,43.21 43.51,41.4 43.51,37.67 46.64,34.55 81.53,34.55 81.53,35.81 78.56,35.81 B3_P8.1
GND  (via drill 0.5)  (28 unrouted)
  Top 0.203: 34.92,30.48 U4.13 v34.62,30.4 | U8.2 89,34.35 C5.2 | U2.13 8.63,31.02 v8.61,31.05 | U1.22 18.23,24.26 | U3.13 v21.62,30.4 | T4.2 v48.6,36.25 | T3.2 48.6,39.61 v48.68,39.69 | T2.2 | T1.2 | U4.9 27.91,30.4 v27.71,30.2 | U4.8 29.09,35.6 v28.59,35.1 | U7.9 29.69,49.13 29.69,50.26 29.42,50.52 16.96,50.52 16.5,50.06 16.5,49.49 U6.9 | v28.17,29.18 30.1,29.18 v30.96,28.32
  Top 0.254: v27.71,30.2 27.71,29.64 v28.17,29.18 | v95.61,15.34 95.61,13.57 90.96,8.93 90.96,8.24 91.45,7.75 93.58,7.75 93.83,8 GND@POT3.1
  Bottom 0.203: v21.62,30.4 21.45,30.4 20.36,29.31 C4.2 | v30.96,28.32 32.03,28.32 v33.43,26.92
  Bottom 0.254: v28.17,29.18 25.46,29.18 24.31,28.04 21.63,28.04 20.36,29.31 | C4.2 21.53,28.95 v21.64,29.06 | v95.61,15.34 96.34,15.34 GND@POT2.1
  other vias: 89.25,34.1 12.67,26.82 48.6,42.6 48.6,45.8 16.79,27.03
  pour Bottom: 0,4 0,54 arc-90 4,58 96,58 arc-90 100,54 100,4 arc-90 96,0 4,0 arc-90
  pour Top: 0,4 0,54 arc-90 4,58 96,58 arc-90 100,54 100,4 arc-90 96,0 4,0 arc-90
KEY_COL_1  (via drill 0.5)
  Top 0.203: K13.2 52.61,5 v51.51,6.1 | v49.6,6.01 49.13,6.01 48.79,6.36
  Top 0.254: K1.2 K5.2 K9.2 K13.2 | U1.12 40.76,6.36 48.79,6.36
  Bottom 0.203: v51.51,6.1 49.68,6.1 v49.6,6.01
KEY_COL_2  (via drill 0.5)
  Top 0.203: K14.2 65.75,6.59 v65.2,7.14 | v60.58,6.99 60.58,6.56 60.79,6.36
  Top 0.254: K2.2 K6.2 K10.2 K14.2 | v54.58,6.68 54.91,6.36 60.79,6.36 | v49.3,7.65 49.11,6.75 49,6.86 40.97,6.86 33.67,14.17 33.67,15.99 U1.13
  Bottom 0.203: v65.2,7.14 60.73,7.14 v60.58,6.99
  Bottom 0.254: v54.58,6.68 52.42,6.91 v49.3,7.65
KEY_COL_3
  Top 0.254: K15.2 K11.2 K7.2 K3.2 74.14,29 72.79,30.36 45.71,30.36 45.18,29.82 45.07,29.82 39.25,24 36.2,24 U1.15
KEY_COL_4
  Top 0.254: K16.2 K12.2 K8.2 K4.2 86.14,29 84.28,30.86 45.36,30.86 40,25.5 36.45,25.5 36.44,25.51 35.17,25.51 U1.16
KEY_ROW_1
  Bottom 0.254: K4.1 80.64,29 79.29,27.64 76.21,27.64 74.86,29 K3.1 68.64,29 67.29,27.64 64.21,27.64 62.86,29 K2.1 56.64,29 55.29,27.64 52.21,27.64 50.86,29 K1.1 47.25,23.89 44.92,21.56 44.92,20.44 45.71,19.64 46.6,19.64 46.74,19.5 46.74,16.1 44.66,14.02 41.75,14.02 36.86,18.91 13.33,18.91 U1.4
KEY_ROW_2
  Bottom 0.254: K8.1 80.64,21 79.29,19.64 76.21,19.64 74.86,21 K7.1 68.64,21 67.29,19.64 64.21,19.64 62.86,21 K6.1 56.64,21 55.29,19.64 52.21,19.64 50.86,21 K5.1 47.25,15.89 44.92,13.56 44.92,13.51 41.54,13.51 36.65,18.4 15.36,18.4 U1.5
KEY_ROW_3
  Bottom 0.254: K12.1 80.64,13 79.29,11.64 76.21,11.64 74.86,13 K11.1 68.64,13 67.29,11.64 64.21,11.64 62.86,13 K10.1 56.64,13 55.29,11.64 52.21,11.64 50.86,13 K9.1 41.33,13 36.44,17.89 17.39,17.89 U1.6
KEY_ROW_4
  Bottom 0.254: K16.1 80.64,5 79.29,3.64 76.21,3.64 74.86,5 K15.1 68.64,5 67.29,3.64 64.21,3.64 62.86,5 K14.1 56.64,5 55.29,3.64 52.21,3.64 50.86,5 K13.1 45.18,5 42.85,2.67 41.91,2.67 35.13,9.45 35.13,12.26 34.91,12.48 32.1,12.48 U1.11
LATCH
  Top 0.254: U1.14 35.6,16.19 33.9,17.89 32.36,17.89 32.25,18 32.25,26.95 32.78,27.48 32.78,29.81 33.36,30.39 | 33.36,30.39 U4.12 | U2.12 7.37,31.07 8.18,31.88 19.62,31.88 20.25,31.25 20.25,30.52 U3.12 20.36,31.07 21.18,31.88 32.62,31.88 33.25,31.25 33.25,30.5 33.36,30.39
MOSI  (via drill 0.5)
  Top 0.203: 12.6,20.45 12.6,20.02 19.2,20.02 v19.96,20.78 | v27.48,20.76 29.47,22.75
  Top 0.254: U2.14 9.96,30.35 9.96,25.29 9.57,24.9 9.57,22.72 | 9.58,22.71 9.57,22.72 | U1.17 30.52,23.81 29.47,22.75 28.82,22.11 | 9.57,22.72 9.57,21.18 10.3,20.45 12.6,20.45
  Bottom 0.203: v19.96,20.78 27.46,20.78 v27.48,20.76
N$1  (via drill 0.5)
  Top 0.254: U2.9 4.14,30.99 4.14,31.66 4.37,31.88 7.46,31.88 7.97,32.39 19.86,32.39 20.37,31.88 20.46,31.88 20.97,32.39 22.42,32.39 v22.75,32.72
  Bottom 0.254: v22.75,32.72 22.75,30.55 U3.14
  other vias: 22.91,30.4
N$2  (via drill 0.5)
  Top 0.254: U3.9 15.4,30.4 v15.25,30.25
  Bottom 0.203: 22.69,26 23.21,26 23.95,25.27 25.21,25.27 25.43,25.49 26.27,25.49 26.57,25.18 27.37,25.98 35.98,25.98 36,26
  Bottom 0.254: v15.25,30.25 15.25,30 16.75,28.5 18.87,28.5 18.87,26.24 19.09,26.02 20.23,26.02 | 20.23,26.02 20.25,26 | 20.23,26.02 22.68,26.02 22.69,26 | 36,26 36,30.3 U4.14
  other vias: 35.91,30.4
N$3
  Bottom 0.254: C2.2 16.46,6.91 Y1.1 17.12,10 U1.9
N$4
  Bottom 0.254: C1.1 21.54,6.91 Y1.2 21.54,11.88 U1.10
N$5
  Top 0.203: U8.5 88.57,38.8 89.53,37.84 94.89,37.84 CLK_OUT.1
N$6  (1 unrouted)
N$7  (via drill 0.5)
  Bottom 0.254: R3.1 37,9 PWR_LED.A
  other vias: 42.5,3.5
N$8
  Top 0.203: QP1.1 53,44.45 T1.3
N$9  (via drill 0.5)
  Top 0.254: U1.20 23.31,26.79 L1.2
  Bottom 0.254: C4.1 23.43,27.05 L1.2
  other vias: 23.5,26.98
N$10
  Top 0.203: QP2.1 53,41.25 T2.3
N$11
  Top 0.203: QP3.1 52.8,38.25 T3.3
N$12
  Top 0.203: QP4.1 52.1,35.75 T4.3
N$13
  Top 0.203: DIV.1 87.75,41 U8.4
N$14
  Top 0.203: CLKSET.1 92.75,46.9 CPT2.1
N$16
  Top 0.203: U8.3 89.95,36.78 88.88,37.84 87.63,37.84 86.59,38.88 86.59,43.98 90.16,47.55 90.64,47.55 CLKSET.2
N$17  (1 unrouted)
POT1  (via drill 0.5)
  Top 0.254: v15.67,21.29 15.67,23.79 U1.23
  Bottom 0.254: POT1.1 92.14,28.5 91.29,27.64 87.5,27.64 84.79,30.36 45.34,30.36 36.59,21.61 15.67,21.61 v15.67,21.29
POT2  (via drill 0.5)
  Top 0.254: v48.08,19.1 39.03,19.1 37.75,20.38 37.06,20.38 36.93,20.25 v33.08,20.25 | v13.21,21.29 13.21,23.75 U1.24
  Bottom 0.254: POT2.1 79.86,19.5 79.5,19.14 48.12,19.14 v48.08,19.1 | v33.08,20.25 33.08,19.98 33.03,19.92 12.73,19.92 12.73,20.8 v13.21,21.29
POT3  (via drill 0.5)
  Top 0.254: v37.38,15.78 37.38,19.52 v37.4,19.55 | v10.64,21.29 10.64,23.78 U1.25
  Bottom 0.254: POT3.1 42.65,10.5 v37.38,15.78 | 12.38,19.55 12.19,19.74 | 12.19,19.74 v10.64,21.29 | 12.19,19.74 12.19,19.73 12.75,19.18 12.88,19.18 13.12,19.42 37.07,19.42 37.41,19.07 37.41,19.54 v37.4,19.55
QP1  (via drill 0.5)
  Top 0.203: v46.02,41.08 47.34,42.4 47.34,45.89 48.6,47.15 T1.1 | v29.06,27.65 24.63,27.65 24.02,28.25 19.86,28.25 | 19.86,28.25 19.85,28.25 | v10.79,27.21 11.27,27.69 11.34,27.69 11.81,28.16 11.81,28.19 11.86,28.25 14.82,28.25 15.03,28.03 17.38,28.03 17.6,28.25 19.86,28.25 | v8.79,26.65 8.79,24.53 U1.26
  Bottom 0.203: v46.02,41.08 41.47,45.63 41.47,49.43 40.73,50.17 30.67,50.17 29.48,48.99 29.48,28.07 v29.06,27.65 | v10.79,27.21 9.35,27.21 v8.79,26.65
QP2  (via drill 0.5)
  Top 0.203: v46.93,40.17 47.79,41.04 47.79,43.15 48.6,43.95 T2.1
  Bottom 0.203: v46.93,40.17 48.21,38.88 48.42,38.88 48.89,38.41 48.89,37.74 48.42,37.27 47.75,37.27 47.62,37.4 43.31,37.4 38.99,33.08 38.99,26.81 37.03,24.85 37.03,22.73 36.43,22.13 34.86,22.13 34.82,22.1 7.24,22.1 U1.27
QP3  (via drill 0.5)
  Top 0.203: v47.07,38.88 47.79,39.61 47.79,39.95 48.6,40.75 T3.1 | v18.09,25.84 20.05,27.79 23.84,27.79 24.44,27.19 28.38,27.19 28.73,26.84 v30.07,26.84
  Bottom 0.203: v47.07,38.88 41.01,44.94 41.01,49.24 40.54,49.71 30.86,49.71 29.94,48.8 29.94,35.91 30.07,35.78 v30.07,26.84 | v18.09,25.84 5.02,25.84 U1.28
QP4  (via drill 0.5)
  Top 0.203: T4.1 48.11,38.1 v48.08,38.08
  Bottom 0.203: v48.08,38.08 42.19,38.08 38,33.89 38,27.32 36.2,25.52 27.56,25.52 U1.19
RESET  (1 unrouted)
  Top 0.254: RESET.1 33,3.83 34.18,5.01 34.18,5.99 34,6.17 34,11.45
  Bottom 0.203: RESET.1 32.38,3.17 31.11,1.91 13.34,1.91 2.54,12.7 S1.4
  Bottom 0.254: R1.2 10.31,12 S1.3 S1.4 2.75,15.95 U1.1
RX
  Top 0.254: RX.1 29.67,3.5 28.49,2.32 27.51,2.32 26.84,2.99 18.73,2.99 9.8,11.92 8.02,11.92 7.35,12.59 7.35,14.37 U1.2
SH_CLK  (via drill 0.5)
  Top 0.203: 13.95,28.92 14.79,28.92 15.22,28.49 17.19,28.49 17.62,28.92 19.02,28.92 19.09,28.99 U3.11 | 13.95,28.92 11.42,28.92 | 13.95,28.92 v14.08,29.05 | v14.28,27.23 16.02,25.49 16.11,25.49 16.71,24.89 16.71,23.24 17.81,22.13 18.65,22.13 19.25,22.73 19.25,24.38 20.35,25.49 21.19,25.49 21.79,24.89 21.79,23.24 22.89,22.13 26.27,22.13 27.08,22.94 v27.22,22.94 | U4.11 32.09,29.52 32.29,29.33 32.29,27.68 31.77,27.15 31.77,25.17 31.67,25.17 31.35,25.49 30.07,25.49 U1.18
  Top 0.254: v11,28.5 11.42,28.92 | v9,28.5 8.58,28.92 6.83,28.92 6,29.75 6,30.3 U2.11
  Bottom 0.203: U1.18 28.09,23.81 v27.22,22.94 | v14.28,27.23 14.28,28.86 v14.08,29.05
  Bottom 0.254: v11,28.5 v9,28.5
TX
  Top 0.254: U1.3 10.06,14.2 10.49,14.2 21.19,3.5 TX.1

### Text on the board
tPlace: FRONT LOGO / PLACEHOLDER | CLK / OUT
bPlace: BACK GRAPHIC PLACEHOLDER
tNames: CorruptCore | Rev: 1.0 | Bank 1 | Bank 2 | Bank 3 | Grant | 1 | 1 | 1 | 2 | 2 | 2 | 3 | 3 | 3 | Quick / Bank | 4 | 4 | 4 | 1 | 5 | 5 | 5 | Yahaha! | 2 | 6 | 6 | 6 | 3 | 7 | 7 | 7 | 4 | 8 | 8 | 8
bNames: Open Source Hardware | GNU General Public License V3